# Altium schematic sheet CW308T_LPC1343_CONN.SchDoc: <Enter Sheet Title>
size Letter; Organization: NewAE Technology Inc.; Address1: 1083 Queen St., Suite 196; Address2: Halifax; Address3: NS; Address4: Canada B3H 0B2; SheetApproved: NO
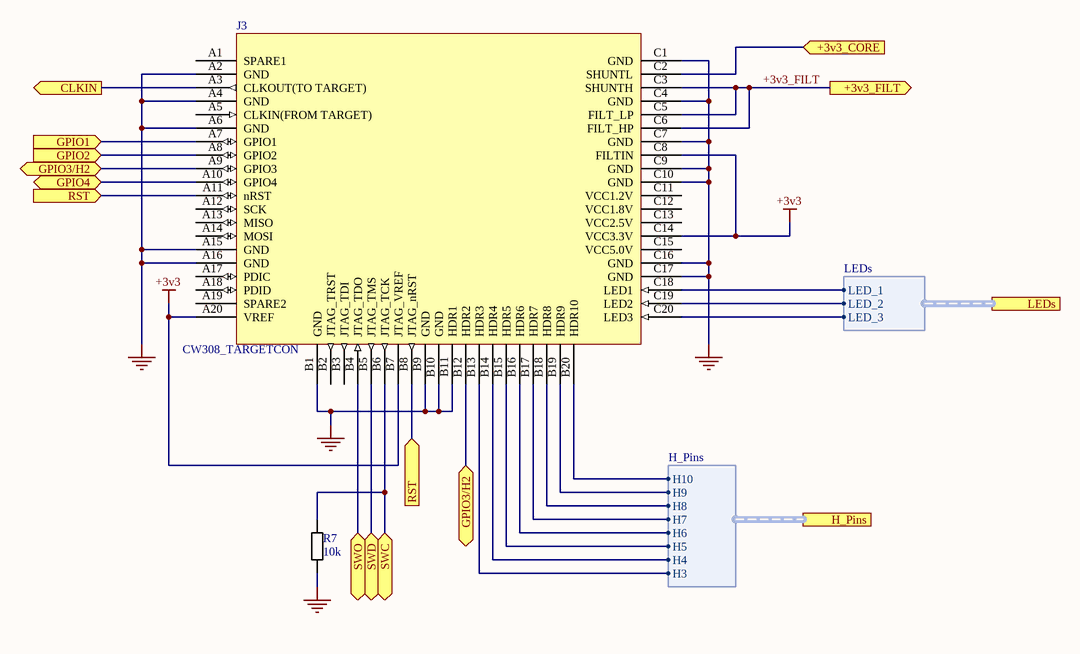
[diagram p0: CW308T_LPC1343_CONN.SchDoc]

## Parts
J3  CW308_TARGETCON  [CW308_TBOARD_CONN]
R7  10k  [RESC1608X55N]

## Ports
+3v3_CORE (in), +3v3_FILT (out), CLKIN (out), GPIO1 (in), GPIO2 (in), GPIO3/H2 (bidir), GPIO4 (bidir), H_Pins (harness H_Pins), LEDs (harness LEDs), RST (in), SWC (bidir), SWD (bidir), SWO (bidir)

## Harnesses
H_Pins: H10, H3, H4, H5, H6, H7, H8, H9
LEDs: LED_1, LED_2, LED_3

## Nets
+3v3: J3.A20(VREF) J3.B7(JTAG_VREF) J3.C8(FILTIN) J3.C14(VCC3.3V)
GND: J3.A2(GND) J3.A4(GND) J3.A6(GND) J3.A15(GND) J3.A16(GND) J3.B1(GND) J3.B9(GND) J3.B10(GND) J3.B11(HDR1) J3.C1(GND) J3.C4(GND) J3.C7(GND) J3.C9(GND) J3.C10(GND) J3.C16(GND) J3.C17(GND) R7.2
+3v3_CORE: J3.C2(SHUNTL) ; port +3v3_CORE
+3v3_FILT: J3.C3(SHUNTH) J3.C5(FILT_LP) J3.C6(FILT_HP) ; port +3v3_FILT
CLKIN: J3.A3(CLKOUT(TO_TARGET)) ; port CLKIN
GPIO1: J3.A7(GPIO1) ; port GPIO1
GPIO2: J3.A8(GPIO2) ; port GPIO2
GPIO3/H2: J3.A9(GPIO3) J3.B12(HDR2) ; port GPIO3/H2
GPIO4: J3.A10(GPIO4) ; port GPIO4
RST: J3.A11(nRST) J3.B8(JTAG_nRST) ; port RST
SWC: J3.B6(JTAG_TCK) R7.1 ; port SWC
SWD: J3.B5(JTAG_TMS) ; port SWD
SWO: J3.B4(JTAG_TDO) ; port SWO
NetJ3_B13: J3.B13(HDR3) ; port H_Pins.H3
NetJ3_B14: J3.B14(HDR4) ; port H_Pins.H4
NetJ3_B15: J3.B15(HDR5) ; port H_Pins.H5
NetJ3_B16: J3.B16(HDR6) ; port H_Pins.H6
NetJ3_B17: J3.B17(HDR7) ; port H_Pins.H7
NetJ3_B18: J3.B18(HDR8) ; port H_Pins.H8
NetJ3_B19: J3.B19(HDR9) ; port H_Pins.H9
NetJ3_B20: J3.B20(HDR10) ; port H_Pins.H10
NetJ3_C18: J3.C18(LED1) ; port LEDs.LED_1
NetJ3_C19: J3.C19(LED2) ; port LEDs.LED_2
NetJ3_C20: J3.C20(LED3) ; port LEDs.LED_3

Not connected (* = marked no-connect by the designer): J3 A1(SPARE1) A5(CLKIN(FROM_TARGET)) A12(SCK) A13(MISO) A14(MOSI) A17(PDIC) A18(PDID) A19(SPARE2) B2(JTAG_TRST) B3(JTAG_TDI) C11(VCC1.2V) C12(VCC1.8V) C13(VCC2.5V) C15(VCC5.0V)

## Notes on the sheet
- Title:
- Date:
- Rev:
- Time:
- Project:
- Sheet
- of
- License:
- Copyright © NewAE Technology Inc.
- Approved:
- NewAE.com
- File:

## Library data of the parts
J3 = CW308_TBOARD: CW308 "Standard" Target Board Connector; Component Group: Mechanical; Pitch: 2.54mm; Part Number: CW308_TBOARD; Pin Count: 60; Mounting Technology: Through-hole; Component Kind: Standard; Component Type: Standard
R7 = RCHIP-10K-0603: 10k res, 0603, 1%, 1/10W; Manufacture 1: Yageo; Manufacture Part Number 1: RC0603FR-0710KL; Component Group: Resistor; Case-EIA: 0603; Case-Metric: 1608; Rated Power: 0.1W; Rated Voltage: 75VDC; Part Number: RCHIP-10K-0603; Footprint: 0603; Pin Count: 2; Supplier 1: Digi-Key; Supplier Part Number 1: 311-10.0KHRCT-ND; Value: 10k; Tolerance: 1%; Mounting Technology: SMT; Temperature Range: -55C to 155C; Component Kind: Standard; Component Type: Standard